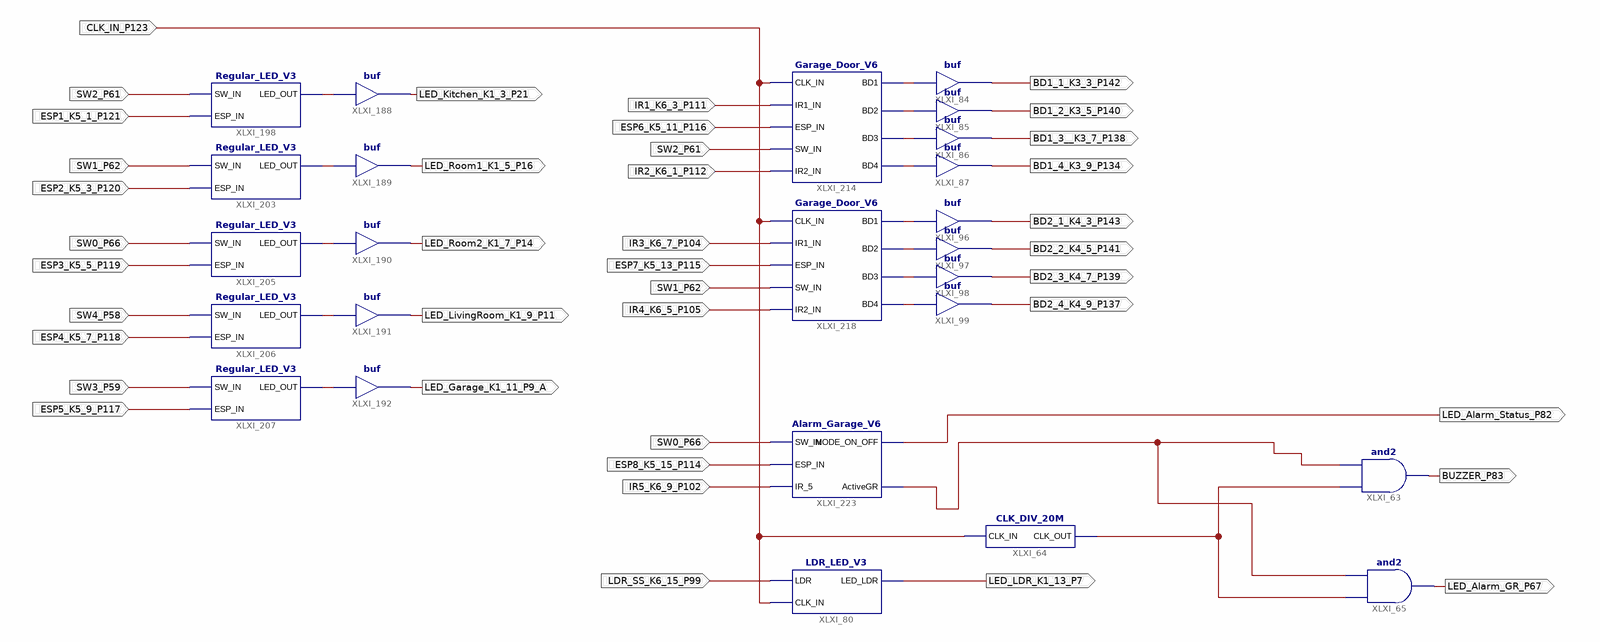
[diagram p0: schematic sheet 1]
// Xilinx ISE schematic AllComps.sch (spartan6) as structural Verilog: 25 symbols, 37 ports
module AllComps (
  input  SW2_P61,
  input  SW1_P62,
  input  SW0_P66,
  input  CLK_IN_P123,
  input  LDR_SS_K6_15_P99,
  input  IR1_K6_3_P111,
  input  ESP1_K5_1_P121,
  input  ESP2_K5_3_P120,
  input  ESP3_K5_5_P119,
  input  ESP4_K5_7_P118,
  input  SW4_P58,
  input  SW3_P59,
  input  ESP5_K5_9_P117,
  input  ESP6_K5_11_P116,
  input  IR2_K6_1_P112,
  input  ESP7_K5_13_P115,
  input  IR4_K6_5_P105,
  input  IR3_K6_7_P104,
  input  ESP8_K5_15_P114,
  input  IR5_K6_9_P102,
  output BD1_1_K3_3_P142,
  output LED_LDR_K1_13_P7,
  output BUZZER_P83,
  output LED_Alarm_GR_P67,
  output LED_Alarm_Status_P82,
  output LED_Kitchen_K1_3_P21,
  output LED_Room1_K1_5_P16,
  output LED_Room2_K1_7_P14,
  output LED_LivingRoom_K1_9_P11,
  output LED_Garage_K1_11_P9_A,
  output BD1_2_K3_5_P140,
  output BD1_3__K3_7_P138,
  output BD1_4_K3_9_P134,
  output BD2_1_K4_3_P143,
  output BD2_2_K4_5_P141,
  output BD2_3_K4_7_P139,
  output BD2_4_K4_9_P137
);

  wire To_ESP_GarageStatus, XLXN_208, XLXN_209, XLXN_210, XLXN_211, XLXN_249, XLXN_250, XLXN_251, XLXN_375,
       XLXN_376, XLXN_377, XLXN_378, XLXN_379, XLXN_451, XLXN_462;

  and XLXI_63 (BUZZER_P83, XLXN_462, To_ESP_GarageStatus);
  CLK_DIV_20M XLXI_64 (.CLK_IN(CLK_IN_P123), .CLK_OUT(XLXN_462));
  LDR_LED_V3 XLXI_80 (.LDR(LDR_SS_K6_15_P99), .CLK_IN(CLK_IN_P123), .LED_LDR(LED_LDR_K1_13_P7));
  and XLXI_65 (LED_Alarm_GR_P67, XLXN_462, To_ESP_GarageStatus);
  buf XLXI_84 (BD1_1_K3_3_P142, XLXN_208);
  buf XLXI_188 (LED_Kitchen_K1_3_P21, XLXN_375);
  Regular_LED_V3 XLXI_198 (.SW_IN(SW2_P61), .ESP_IN(ESP1_K5_1_P121), .LED_OUT(XLXN_375));
  Regular_LED_V3 XLXI_203 (.SW_IN(SW1_P62), .ESP_IN(ESP2_K5_3_P120), .LED_OUT(XLXN_376));
  Regular_LED_V3 XLXI_205 (.SW_IN(SW0_P66), .ESP_IN(ESP3_K5_5_P119), .LED_OUT(XLXN_377));
  Regular_LED_V3 XLXI_206 (.SW_IN(SW4_P58), .ESP_IN(ESP4_K5_7_P118), .LED_OUT(XLXN_378));
  Regular_LED_V3 XLXI_207 (.SW_IN(SW3_P59), .ESP_IN(ESP5_K5_9_P117), .LED_OUT(XLXN_379));
  buf XLXI_189 (LED_Room1_K1_5_P16, XLXN_376);
  buf XLXI_190 (LED_Room2_K1_7_P14, XLXN_377);
  buf XLXI_191 (LED_LivingRoom_K1_9_P11, XLXN_378);
  buf XLXI_192 (LED_Garage_K1_11_P9_A, XLXN_379);
  Garage_Door_V6 XLXI_214 (
    .CLK_IN(CLK_IN_P123), .IR1_IN(IR1_K6_3_P111), .ESP_IN(ESP6_K5_11_P116), .SW_IN(SW2_P61),
    .IR2_IN(IR2_K6_1_P112), .BD1(XLXN_208), .BD2(XLXN_209), .BD3(XLXN_210), .BD4(XLXN_211));
  buf XLXI_85 (BD1_2_K3_5_P140, XLXN_209);
  buf XLXI_86 (BD1_3__K3_7_P138, XLXN_210);
  buf XLXI_87 (BD1_4_K3_9_P134, XLXN_211);
  Garage_Door_V6 XLXI_218 (
    .CLK_IN(CLK_IN_P123), .IR1_IN(IR3_K6_7_P104), .ESP_IN(ESP7_K5_13_P115), .SW_IN(SW1_P62),
    .IR2_IN(IR4_K6_5_P105), .BD1(XLXN_451), .BD2(XLXN_249), .BD3(XLXN_251), .BD4(XLXN_250));
  buf XLXI_96 (BD2_1_K4_3_P143, XLXN_451);
  buf XLXI_97 (BD2_2_K4_5_P141, XLXN_249);
  buf XLXI_98 (BD2_3_K4_7_P139, XLXN_251);
  buf XLXI_99 (BD2_4_K4_9_P137, XLXN_250);
  Alarm_Garage_V6 XLXI_223 (
    .SW_IN(SW0_P66), .ESP_IN(ESP8_K5_15_P114), .IR_5(IR5_K6_9_P102), .MODE_ON_OFF(LED_Alarm_Status_P82),
    .ActiveGR(To_ESP_GarageStatus));
endmodule
